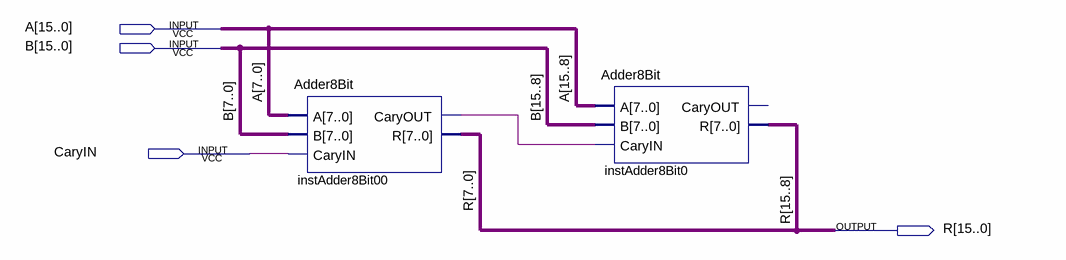
[diagram p0: schematic sheet]
// Quartus schematic Add16bitCaryin.bdf as structural Verilog: 2 symbols, 4 pins
module Add16bitCaryin (
  input  [15:0] A,
  input  [15:0] B,
  input  CaryIN,
  output [15:0] R
);

  wire instAdder8Bit00_caryout;

  Adder8Bit instAdder8Bit00 (.A(A[7:0]), .B(B[7:0]), .CaryIN(CaryIN), .CaryOUT(instAdder8Bit00_caryout), .R(R[7:0]));
  Adder8Bit instAdder8Bit0 (.A(A[15:8]), .B(B[15:8]), .CaryIN(instAdder8Bit00_caryout), .R(R[15:8]));  // open: CaryOUT
endmodule
